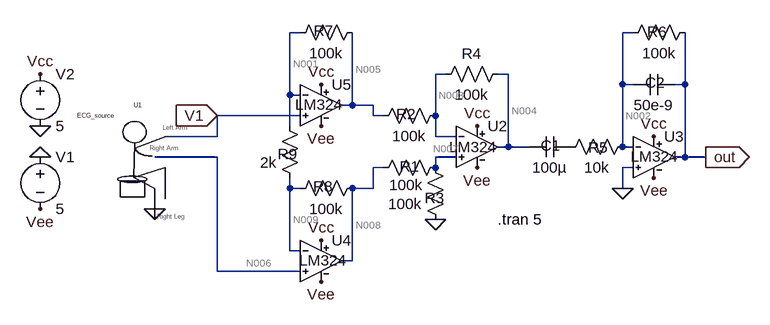
[diagram p0: schematic Draft12.asc]
Draft12.asc, the LTspice schematic file:
Version 4
SHEET 1 1700 680
WIRE 576 160 560 160
WIRE 1088 160 1072 160
WIRE 800 224 784 224
WIRE 896 224 880 224
WIRE 1072 240 1072 160
WIRE 1088 240 1072 240
WIRE 1168 240 1168 160
WIRE 1168 240 1152 240
WIRE 560 256 560 160
WIRE 576 256 560 256
WIRE 656 272 656 160
WIRE 656 272 640 272
WIRE 688 272 656 272
WIRE 576 288 448 288
WIRE 688 288 688 272
WIRE 704 288 688 288
WIRE 784 288 784 224
WIRE 560 304 560 256
WIRE 448 320 448 288
WIRE 448 320 368 320
WIRE 784 320 784 288
WIRE 816 320 784 320
WIRE 896 336 896 224
WIRE 896 336 880 336
WIRE 928 336 896 336
WIRE 1072 336 1072 240
WIRE 1088 336 1072 336
WIRE 448 352 352 352
WIRE 816 352 784 352
WIRE 1168 352 1168 240
WIRE 1168 352 1152 352
WIRE 1200 352 1168 352
WIRE 704 368 688 368
WIRE 784 368 784 352
WIRE 1088 368 1072 368
WIRE 560 400 560 384
WIRE 576 400 560 400
WIRE 688 400 688 368
WIRE 688 400 656 400
WIRE 1072 400 1072 368
WIRE 560 496 560 400
WIRE 576 496 560 496
WIRE 656 512 656 400
WIRE 656 512 640 512
WIRE 448 528 448 352
WIRE 576 528 448 528
FLAG 352 432 0
FLAG 176 304 0
FLAG 176 352 0
FLAG 176 224 Vcc
FLAG 176 432 Vee
FLAG 848 368 Vee
FLAG 848 304 Vcc
FLAG 784 448 0
FLAG 1072 400 0
FLAG 1120 384 Vee
FLAG 1120 320 Vcc
FLAG 1200 352 out
IOPIN 1200 352 Out
FLAG 608 240 Vcc
FLAG 608 480 Vcc
FLAG 608 304 Vee
FLAG 608 544 Vee
FLAG 448 288 V1
IOPIN 448 288 In
SYMBOL human 320 368 R0
SYMATTR InstName U1
SYMBOL res 800 352 R90
WINDOW 0 30 56 VBottom 2
WINDOW 3 27 61 VTop 2
SYMATTR InstName R1
SYMATTR Value 100k
SYMBOL res 800 272 R90
WINDOW 0 29 61 VBottom 2
WINDOW 3 32 56 VTop 2
SYMATTR InstName R2
SYMATTR Value 100k
SYMBOL res 800 464 R180
WINDOW 0 2 49 Left 2
WINDOW 3 36 40 Left 2
SYMATTR InstName R3
SYMATTR Value 100k
SYMBOL LM324 848 272 R0
WINDOW 3 -43 64 Left 2
SYMATTR InstName U2
SYMBOL voltage 176 336 R0
SYMATTR InstName V1
SYMATTR Value 5
SYMBOL voltage 176 208 R0
SYMATTR InstName V2
SYMATTR Value 5
SYMBOL res 896 208 R90
WINDOW 0 0 56 VBottom 2
WINDOW 3 32 56 VTop 2
SYMATTR InstName R4
SYMATTR Value 100k
SYMBOL cap 992 320 R90
WINDOW 0 30 31 VBottom 2
WINDOW 3 32 32 VTop 2
SYMATTR InstName C1
SYMATTR Value 100µ
SYMBOL res 1088 320 R90
WINDOW 0 33 54 VBottom 2
WINDOW 3 32 56 VTop 2
SYMATTR InstName R5
SYMATTR Value 10k
SYMBOL LM324 1120 288 R0
WINDOW 3 -36 63 Left 2
SYMATTR InstName U3
SYMBOL cap 1152 224 R90
WINDOW 0 29 30 VBottom 2
WINDOW 3 32 32 VTop 2
SYMATTR InstName C2
SYMATTR Value 50e-9
SYMBOL res 1184 144 R90
WINDOW 0 30 59 VBottom 2
WINDOW 3 32 56 VTop 2
SYMATTR InstName R6
SYMATTR Value 100k
SYMBOL LM324 608 448 R0
WINDOW 3 -34 63 Left 2
SYMATTR InstName U4
SYMBOL LM324 608 208 R0
WINDOW 3 -40 63 Left 2
SYMATTR InstName U5
SYMBOL res 672 144 R90
WINDOW 0 29 60 VBottom 2
WINDOW 3 32 56 VTop 2
SYMATTR InstName R7
SYMATTR Value 100k
SYMBOL res 672 384 R90
WINDOW 0 29 61 VBottom 2
WINDOW 3 32 56 VTop 2
SYMATTR InstName R8
SYMATTR Value 100k
SYMBOL res 576 400 R180
WINDOW 0 4 53 Left 2
WINDOW 3 36 40 Left 2
SYMATTR InstName R9
SYMATTR Value 2k
TEXT 880 448 Left 2 !.tran 5

The netlist it stands for:
* Draft12.asc
XU1 V1 N006 0 ECG_source  ; pins LA RA RL
R1 N007 N008 100k
R2 N003 N005 100k
R3 0 N007 100k
XU2 N007 N003 Vcc Vee N004 LM324  ; pins In+ In- V+ V- OUT
V1 0 Vee 5
V2 Vcc 0 5
R4 N004 N003 100k
C1 P001 N004 100µ
R5 N002 P001 10k
XU3 0 N002 Vcc Vee out LM324  ; pins In+ In- V+ V- OUT
C2 out N002 50e-9
R6 out N002 100k
XU4 N006 N009 Vcc Vee N008 LM324  ; pins In+ In- V+ V- OUT
XU5 V1 N001 Vcc Vee N005 LM324  ; pins In+ In- V+ V- OUT
R7 N005 N001 100k
R8 N008 N009 100k
R9 N009 N001 2k
.tran 5
.lib human.sub
.lib LM324.lib
.backanno
.end

* Results of the author's LTspice run, read from the files saved beside the schematic
* Operating Point, zero values left out:
*   V(v1) = 20.14 mV
*   V(n006) = 19.71 mV
*   V(n007) = -828.1 µV
*   V(n008) = -3.649 mV
*   V(n003) = -861.3 µV
*   V(n005) = 39.44 mV
*   V(n004) = -43.16 mV
*   V(vee) = -5 V
*   V(vcc) = 5 V
*   V(p001) = -33.64 µV
*   V(n002) = -33.64 µV
*   V(out) = -2.028 mV
*   V(n009) = 19.68 mV
*   V(n001) = 20.1 mV
*   I(R9) = -213.3 nA
*   I(R8) = -233.3 nA
*   I(R7) = 193.4 nA
*   I(R6) = -19.94 nA
*   I(R4) = -423 nA
*   I(R3) = 8.281 nA
*   I(R2) = -403 nA
*   I(R1) = 28.21 nA
*   I(V2) = -1.36 mA
*   I(V1) = -1.36 mA